# EasyEDA Pro project TOF_Sensor_Unit_v02_single.eprj

# Schematic Schematic1
Board Name: Board1; Create Date: 2026-03-25; Page Name: P1; Project Name: TOF_Sensor_Unit_v02_single; Schematic Name: Schematic1; Update Date: 2026-03-25; Company: EasyEDA.com; Drawn: EasyEDA; Page Size: A4; Part Number: JLCPCB-002; Reviewed: EasyEDA; Version: V0.1
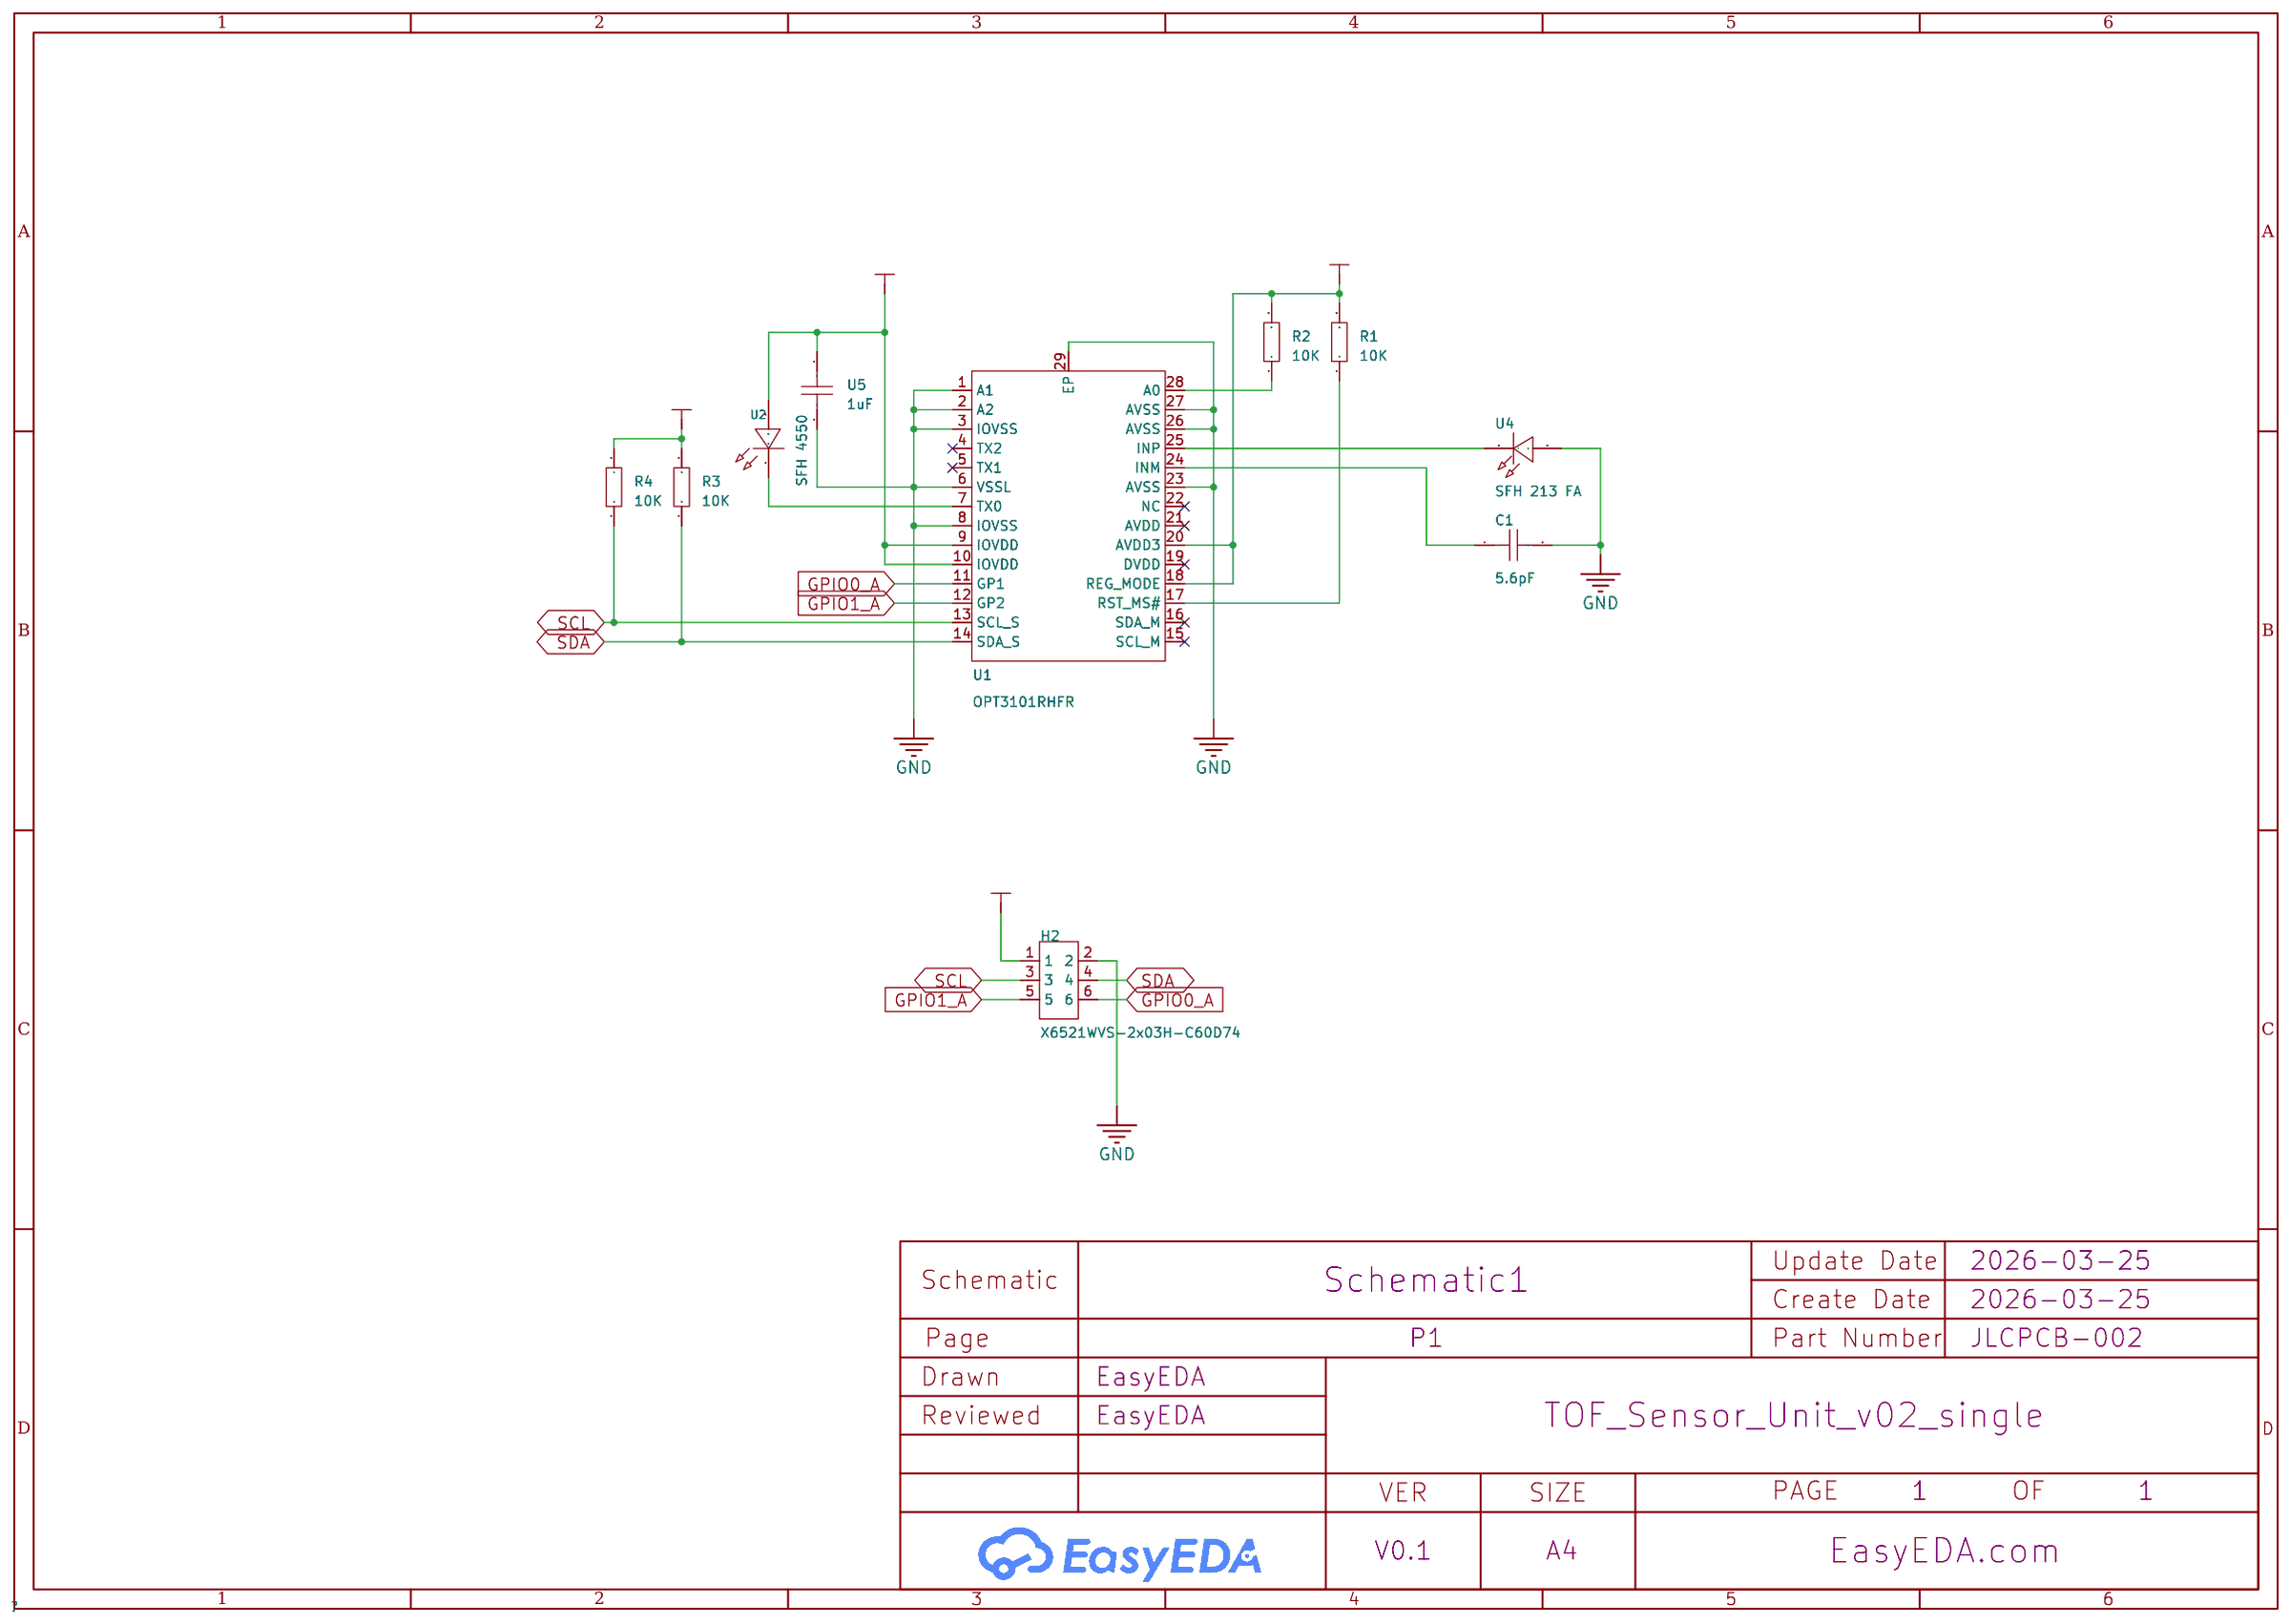
[diagram p0: schematic sheet]

## Parts
C1  5.6pF  [C0402]
H2  X6521WVS-2x03H-C60D74  [HDR-SMD_6P-P2.54-V-M-R2-C5-S7.4]
R1  10K  [R0603]
R2  10K  [R0603]
R3  10K  [R0603]
R4  10K  [R0603]
U1  OPT3101RHFR  [QFN-28_L5.0-W4.0-P0.50-BL-EP]
U2  SFH 4550  [LED-TH_BD5.9-P2.54-RD]
U4  SFH 213 FA  [OPTO-TH_BD5.8-P2.54-R-FD]
U5  1uF  [C0402]

## Library data of the parts
C1 = CC0402BRNPO9BN5R6: LCSC Part Name: ±0.1pF 5.6pF 50V; Supplier Part: C505468; Manufacturer: YAGEO(国巨); Supplier Footprint: 0402; JLCPCB Part Class: Extended Part; Datasheet: https://item.szlcsc.com/datasheet/CC0402BRNPO9BN5R6/518679.html; Supplier: LCSC; Voltage Rating: 50V; Temperature Coefficient: NP0
H2 = X6521WVS-2x03H-C60D74: Pin Structure:2x3P Pitch:2.54mm Row Spacing:2.54mm Circluar Pins/Square Pins:Pin Header Number of Rows:2 Number of Pins:6P Current Rating:3A Voltage Rating (Max):250V Length of Mating Pin:- Insulation Height:2.5mm Length of End Connection Pin:- Contact Ma; LCSC Part Name: 2x3P 间距:2.54mm 方针; Supplier Part: C780054; Manufacturer: XKB Connection(中国星坤); Supplier Footprint: SMD,P=2.54mm; JLCPCB Part Class: Extended Part; Datasheet: https://item.szlcsc.com/datasheet/X6521WVS-2x03H-C60D74/831904.html; Supplier: LCSC; Pin Structure: 2x3P; Pitch: 2.54mm; Row Spacing: 2.54mm; Circluar Pins/Square Pins: Pin Header; Number of Rows: 2; Number of Pins: 6P; Current Rating: 3A; Voltage Rating (Max): 250V; Insulation Height: 2.5mm; Contact Material: Brass; Contact Plating: Gold; Operating Temperature: -40℃~+105℃; Color: Black
R1-R4 = Res_0603: DNI; Supplier Footprint: 0603
U1 = OPT3101RHFR: LCSC Part Name: 基于ToF的远距离接近和距离传感器AFE; Supplier Part: C2867533; Manufacturer: TI(德州仪器); Supplier Footprint: QFN-28-EP(4x5); JLCPCB Part Class: Extended Part; Datasheet: https://www.ti.com/cn/lit/gpn/opt3101; Supplier: LCSC
U2 = SFH 4550: Voltage - Forward(Vf):1.5V Voltage - Forward(Vf):1.5V Wavelength:860nm Wavelength:860nm Radiant Intensity:1100mW/sr@100mA Operating Temperature:-40℃~+100℃ Operating Temperature:-40℃~+100℃; LCSC Part Name: 光电二极管; Supplier Part: C2900376; Manufacturer: OSRAM(欧司朗); Supplier Footprint: 插件,D=5.7mm; JLCPCB Part Class: Extended Part; Datasheet: https://item.szlcsc.com/datasheet/SFH%25204550/3148303.html; Supplier: LCSC; Voltage - Forward(Vf): 1.5V; Wavelength: 860nm; Radiant Intensity: 1100mW/sr@100mA; Operating Temperature: -40℃~+100℃
U4 = SFH 213 FA: Voltage - DC Reverse(Vr):50V Viewing Angle:10° Peak Wavelength:900nm Spectral Range:750nm~1100nm Spectral Range:750nm~1100nm Dark Current:1nA Operating Temperature:-40℃~+100℃ Operating Temperature:-40℃~+100℃ Pd - Power Dissipation:150mW; LCSC Part Name: 光电二极管; Supplier Part: C2900211; Manufacturer: OSRAM(欧司朗); Supplier Footprint: 插件,D=4.8mm; JLCPCB Part Class: Extended Part; Datasheet: https://item.szlcsc.com/datasheet/SFH%2520213%2520FA/3148138.html; Supplier: LCSC; Voltage - DC Reverse(Vr): 50V; Viewing Angle: 10°; Peak Wavelength: 900nm; Spectral Range: 750nm~1100nm; Dark Current: 1nA; Operating Temperature: -40℃~+100℃; Pd - Power Dissipation: 150mW
U5 = CGA0402X5R105K100GT: LCSC Part Name: 1uF ±10% 10V; Supplier Part: C7503520; Manufacturer: HRE(芯声); Supplier Footprint: 0402; JLCPCB Part Class: Extended Part; Datasheet: https://item.szlcsc.com/datasheet/CGA0402X5R105K100GT/8593418.html; Supplier: LCSC; Tolerance: ±10%; Voltage Rating: 10V; Temperature Coefficient: X5R

## Nets
3V3: H2.1 R1.2 R2.2 R3.2 R4.2 U1.9(IOVDD) U1.10(IOVDD) U1.18(REG_MODE) U1.20(AVDD3) U2.2 U5.1
GND: C1.2 H2.2 U1.1(A1) U1.2(A2) U1.3(IOVSS) U1.6(VSSL) U1.8(IOVSS) U1.23(AVSS) U1.26(AVSS) U1.27(AVSS) U1.29(EP) U4.2(+) U5.2
GPIO0_A: H2.6 U1.11(GP1)
GPIO1_A: H2.5 U1.12(GP2)
SCL: H2.3 R4.1 U1.13(SCL_S)
SDA: H2.4 R3.1 U1.14(SDA_S)
$1N6180: U1.25(INP) U4.1(-)
$1N6264: C1.1 U1.24(INM)
$1N6400: R1.1 U1.17(RST_MS#)
$1N6500: R2.1 U1.28(A0)
$1N6926: U1.7(TX0) U2.1

Not connected (* = marked no-connect by the designer): U1 4(TX2)* 5(TX1)* 15(SCL_M)* 16(SDA_M)* 19(DVDD)* 21(AVDD)* 22(NC)*

# Board PCB1
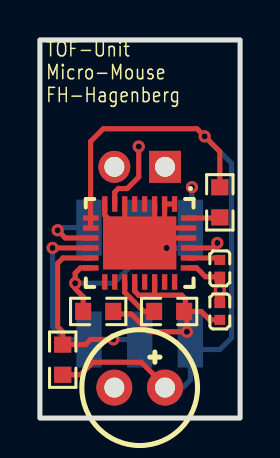
[diagram p1: board, top side]
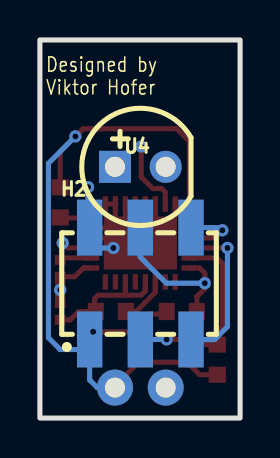
[diagram p2: board, bottom side, seen from below]

Outline 10.03 x 18.92 mm; copper layers: Top Layer, Inner1, Inner2, Bottom Layer. Coordinates in mm from the lower left corner of the outline.
Outline path: rectangle 0,18.92 10.03,0
Stack: Top Layer 0.035mm Outer layer thickness 1oz / Dielectric1 0.2104mm 7628 RC49% 8.6mil / Inner1 0.0152mm Inner layer thickness / Dielectric2 1.065mm 1.1mm H/HOZ Copper / Inner2 0.0152mm Inner layer thickness / Dielectric3 0.2104mm 7628 RC49% 8.6mil / Bottom Layer 0.035mm Outer layer thickness 1oz

## Design rules (mm)
template: JLCPCB Capability(Two Layers Board)
spacing copperThickness1oz (default): track to track 0.102, other pairs 0.152 to 0.3
spacing copperThickness2oz: track to track 0.203, other pairs 0.152 to 0.3
track width copperThickness1oz (default): min 0.127, default 0.254, max 2.54
track width copperThickness2oz: min 0.203, default 0.254, max 2.54
differential pair differentialPair (default): width min 0.127, default 0.254, max 2.54; gap min 0.152, default 0.152
via viaSize (default): diameter min 0.5, default 0.61, max 10; hole min 0.3, default 0.305, max 6.3

## Placement (name value [footprint] x y rotation side)
C1  5.6pF  [C0402]  9.02 7.49 270 top
H2  X6521WVS-2x03H-C60D74  [HDR-SMD_6P-P2.54-V-M-R2-C5-S7.4]  5 6.73 180 bottom
R1  10K  [R0603]  6.48 5.33 0 top
R2  10K  [R0603]  9.02 10.8 90 top
R3  10K  [R0603]  2.92 5.33 0 top
R4  10K  [R0603]  1.14 2.92 270 top
U1  OPT3101RHFR  [QFN-28_L5.0-W4.0-P0.50-BL-EP]  5 8.76 180 top
U2  SFH 4550  [LED-TH_BD5.9-P2.54-RD]  5 1.52 0 top
U4  SFH 213 FA  [OPTO-TH_BD5.8-P2.54-R-FD]  5 12.57 180 bottom
U5  1uF  [C0402]  9.02 5.33 90 top

## Footprints (pads in the part's own frame, mm; a bottom-side part is the same pattern mirrored in y, then rotated)
C0402
  rect 0.5x0.54 smd: 1(-0.42,0) 2(0.42,0)
HDR-SMD_6P-P2.54-V-M-R2-C5-S7.4
  rect 1.27x2.8 smd: 1(-2.54,-2.8) 2(-2.54,2.8) 3(0,-2.8) 4(0,2.8) 5(2.54,-2.8) 6(2.54,2.8)
LED-TH_BD5.9-P2.54-RD
  round 1.8 hole 1: 1(-1.27,0) 2(1.27,0)
OPTO-TH_BD5.8-P2.54-R-FD
  round 1.6 hole 1: 1(1.27,0)
  rect 1.6x1.6 hole 1: 2(-1.27,0)
QFN-28_L5.0-W4.0-P0.50-BL-EP
  rect 0.267x0.774 smd: 1(-1.75,-1.95) 2(-1.25,-1.95) 3(-0.75,-1.95) 4(-0.25,-1.95) 5(0.25,-1.95) 6(0.75,-1.95) 7(1.25,-1.95) 8(1.75,-1.95) 15(1.75,1.95) 16(1.25,1.95) 17(0.75,1.95) 18(0.25,1.95) 19(-0.25,1.95) 20(-0.75,1.95) 21(-1.25,1.95) 22(-1.75,1.95)
  rect 0.775x0.267 smd: 9(2.45,-1.25) 10(2.45,-0.75) 11(2.45,-0.25) 12(2.45,0.25) 13(2.45,0.75) 14(2.45,1.25) 23(-2.45,1.25) 24(-2.45,0.75) 25(-2.45,0.25) 26(-2.45,-0.25) 27(-2.45,-0.75) 28(-2.45,-1.25)
  rect 3.67x2.654 smd: 29(0,0)
R0603
  rect 0.806x0.864 smd: 1(-0.753,0) 2(0.753,0)

## Nets
As in the schematic.

Pads without a net: U1 4 5 15 16 19 21 22

## Via types
v1: diameter 0.61, hole 0.305, Top Layer to Bottom Layer, 11 vias

## Routing (per net, layer and track width the routed paths; a pad name or vN(x,y) marks a point on that pad's centre or on a via; arc(x,y) is an arc through that point)
3V3: length 48
  Top Layer w0.254: 5.74,6.15 5.75,6.15 U1.20 ; 5.74,6.15 4.95,6.15 4.75,6.35 U1.18 ; 5.74,6.15 7.11,6.15 7.29,5.97 7.29,5.39 R1.2 ; U1.10 2.54,9.52 2.54,13.84 3.18,14.48 7.87,14.48 v1(8.25,14.1) 9.02,13.33 R2.2 ; R1.2 7.37,5.2 v1(7.37,4.32) 5.46,4.32 4.57,5.21 3.8,5.21 R3.2 ; R1.2 8.09,5.33 8.51,4.91 U5.1 ; U2.2 6.27,1.6 5.08,2.79 2.66,2.79 2.03,2.17 R4.2
  Bottom Layer w0.254: H2.1 7.54,1.91 7.16,1.52 U2.2 ; H2.1 8.04,3.43 9.02,3.43 9.61,4.02 9.61,12.75 v1(8.25,14.1) ; H2.1 7.54,4.14 v1(7.37,4.32)
GND: length 19.7
  Top Layer w0.254: U1.27 5.75,9.51 ; 5.75,9.51 5.75,10.71 ; 5.75,9.51 6.25,10.01 6.25,10.71 6.75,10.71 ; U1.29 5.25,9.01 U1.26 ; U1.29 4.65,8.76 3.25,10.16 3.25,10.71 ; U1.29 4.25,9.51 4.25,10.71 ; U1.23 7.85,7.51 8.29,7.07 C1.2
  Top Layer w0.508: C1.2 v1(9.02,6.42) U5.2
  Bottom Layer w0.254: v1(6.35,8.51) 7.54,8.51 7.54,9.53 ; 7.62,9.61 v1(7.62,11.56)
GPIO0_A: length 3.4
  Top Layer w0.254: U1.11 1.27,9.01 v1(0.89,9.4)
  Bottom Layer w0.254: v1(0.89,9.4) 1.02,9.53 2.46,9.53
GPIO1_A: length 7.9
  Top Layer w0.254: U1.12 v1(0.63,8.51)
  Bottom Layer w0.254: v1(0.63,8.51) 0.63,4.57 1.28,3.93 H2.5
SCL: length 9.9
  Top Layer w0.254: U1.13 1.16,8.01 0.89,7.75 0.89,4.57 1.14,4.32 R4.1 2.28,3.67 2.54,3.94 v1(3.68,3.94)
  Bottom Layer w0.254: v1(3.68,3.94) 3.69,3.93 H2.3
SDA: length 8.2
  Top Layer w0.254: R3.1 2.17,6.08 1.77,6.48 1.77,7.25 2.03,7.51 U1.14
  Bottom Layer w0.254: v1(1.77,6.75) 3.7,6.75 5,8.05 5,9.53
$1N6180: length 16.5
  Top Layer w0.254: v1(8.89,8.76) 8.64,8.51 U1.25
  Inner2 w0.254: U4.1 3.76,12.6 3.76,15.57 3.94,15.75 8.51,15.75 8.89,15.37 v1(8.89,8.76)
$1N6264: length 1.6
  Top Layer w0.254: C1.1 8.92,8.01 U1.24
$1N6400: length 2.4
  Top Layer w0.254: R1.1 5.21,5.33 4.25,6.29 U1.17
$1N6500: length 1.6
  Top Layer w0.254: U1.28 8.99,10.01 R2.1
$1N6926: length 16.2
  Top Layer w0.254: 3.75,10.71 3.75,11.3 3.93,11.48 4.37,11.48 4.95,12.06 v1(4.95,13.59)
  Inner2 w0.254: U2.1 3.73,1.95 4.44,2.67 4.44,11.56 4.95,12.06 v1(4.95,13.59)

## Copper pours and planes (outline as drawn; the poured copper is in the pictures)
GND on Inner1: 0.26,18.67 9.78,18.67 9.78,0.26 0.26,0.26

Small or netless copper shapes (teardrops, artwork), in the pictures only: 4 on Inner1

## Text on the board
Bottom Silkscreen Layer: Designed by / Viktor Hofer
Top Silkscreen Layer: TOF-Unit / Micro-Mouse / FH-Hagenberg
